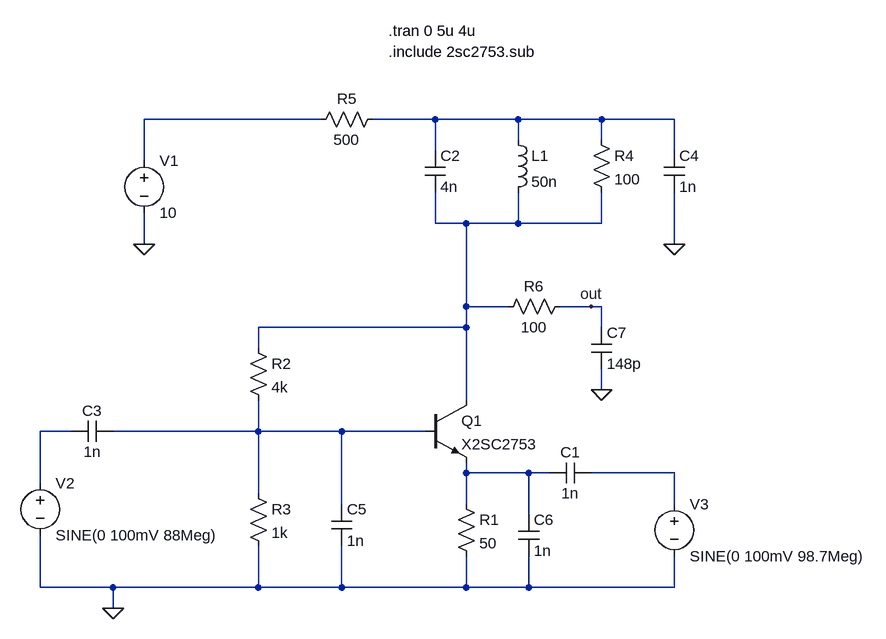
[diagram p0: schematic mixer.asc]
mixer.asc, the LTspice schematic file:
Version 4
SHEET 1 1396 852
WIRE 32 -128 -240 -128
WIRE 208 -128 112 -128
WIRE 336 -128 208 -128
WIRE 464 -128 336 -128
WIRE 576 -128 464 -128
WIRE 336 -96 336 -128
WIRE 464 -96 464 -128
WIRE 208 -80 208 -128
WIRE 576 -80 576 -128
WIRE -240 -64 -240 -128
WIRE 208 32 208 -16
WIRE 256 32 208 32
WIRE 336 32 336 -16
WIRE 336 32 256 32
WIRE 464 32 464 -16
WIRE 464 32 336 32
WIRE -240 64 -240 16
WIRE 576 64 576 -16
WIRE 256 160 256 32
WIRE 320 160 256 160
WIRE 448 160 400 160
WIRE 464 160 448 160
WIRE 256 192 256 160
WIRE 256 192 -64 192
WIRE 464 192 464 160
WIRE -64 224 -64 192
WIRE 464 288 464 256
WIRE 256 304 256 192
WIRE -352 352 -400 352
WIRE -64 352 -64 304
WIRE -64 352 -288 352
WIRE 64 352 -64 352
WIRE 192 352 64 352
WIRE 256 416 256 400
WIRE 352 416 256 416
WIRE 384 416 352 416
WIRE 576 416 448 416
WIRE -400 432 -400 352
WIRE -64 448 -64 352
WIRE 64 464 64 352
WIRE 256 464 256 416
WIRE 576 464 576 416
WIRE 352 480 352 416
WIRE -400 592 -400 512
WIRE -288 592 -400 592
WIRE -64 592 -64 528
WIRE -64 592 -288 592
WIRE 64 592 64 528
WIRE 64 592 -64 592
WIRE 256 592 256 544
WIRE 256 592 64 592
WIRE 352 592 352 544
WIRE 352 592 256 592
WIRE 576 592 576 544
WIRE 576 592 352 592
WIRE -288 624 -288 592
FLAG -240 64 0
FLAG 448 160 out
FLAG 576 64 0
FLAG -288 624 0
FLAG 464 288 0
SYMBOL npn 192 304 R0
SYMATTR InstName Q1
SYMATTR Value X2SC2753
SYMATTR Prefix X1
SYMBOL Cap 192 -80 R0
SYMATTR InstName C2
SYMATTR Value 4n
SYMBOL ind 320 -112 R0
SYMATTR InstName L1
SYMATTR Value 50n
SYMBOL Res 240 448 R0
SYMATTR InstName R1
SYMATTR Value 50
SYMBOL Cap 448 400 R90
WINDOW 0 0 32 VBottom 2
WINDOW 3 32 32 VTop 2
SYMATTR InstName C1
SYMATTR Value 1n
SYMBOL Cap -288 336 R90
WINDOW 0 0 32 VBottom 2
WINDOW 3 32 32 VTop 2
SYMATTR InstName C3
SYMATTR Value 1n
SYMBOL voltage -240 -80 R0
SYMATTR InstName V1
SYMATTR Value 10
SYMBOL voltage -400 416 R0
SYMATTR InstName V2
SYMATTR Value SINE(0 100mV 88Meg)
SYMBOL voltage 576 448 R0
WINDOW 123 0 0 Left 0
WINDOW 39 0 0 Left 0
SYMATTR InstName V3
SYMATTR Value SINE(0 100mV 98.7Meg)
SYMBOL Res -80 208 R0
SYMATTR InstName R2
SYMATTR Value 4k
SYMBOL Res -80 432 R0
SYMATTR InstName R3
SYMATTR Value 1k
SYMBOL res 128 -144 R90
WINDOW 0 0 56 VBottom 2
WINDOW 3 32 56 VTop 2
SYMATTR InstName R5
SYMATTR Value 500
SYMBOL cap 560 -80 R0
SYMATTR InstName C4
SYMATTR Value 1n
SYMBOL res 448 -112 R0
SYMATTR InstName R4
SYMATTR Value 100
SYMBOL cap 48 464 R0
SYMATTR InstName C5
SYMATTR Value 1n
SYMBOL cap 336 480 R0
SYMATTR InstName C6
SYMATTR Value 1n
SYMBOL res 416 144 R90
WINDOW 0 0 56 VBottom 2
WINDOW 3 32 56 VTop 2
SYMATTR InstName R6
SYMATTR Value 100
SYMBOL cap 448 192 R0
SYMATTR InstName C7
SYMATTR Value 148p
TEXT 136 -264 Left 2 !.tran 0 5u 4u
TEXT 136 -232 Left 2 !.include 2sc2753.sub

The netlist it stands for:
* mixer.asc
XQ1 N003 N005 N006 X2SC2753  ; pins C B E
C2 N002 N003 4n
L1 N002 N003 50n
R1 N006 0 50
C1 N007 N006 1n
C3 N005 N004 1n
V1 N001 0 10
V2 N004 0 SINE(0 100mV 88Meg)
V3 N007 0 SINE(0 100mV 98.7Meg)
R2 N003 N005 4k
R3 N005 0 1k
R5 N002 N001 500
C4 N002 0 1n
R4 N002 N003 100
C5 N005 0 1n
C6 N006 0 1n
R6 out N003 100
C7 out 0 148p
.tran 0 5u 4u
.include 2sc2753.sub
.backanno
.end